# EasyEDA Pro project 通用F405飞控_2025-10-26.epro, board PCB1
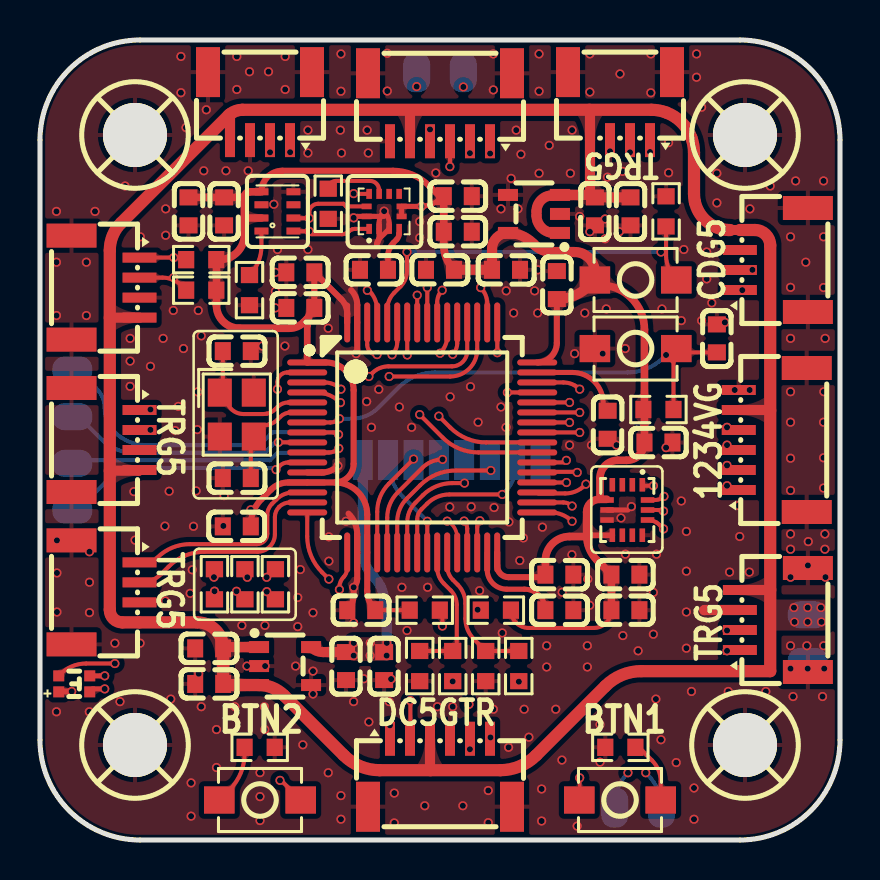
[diagram p3: board, top side]
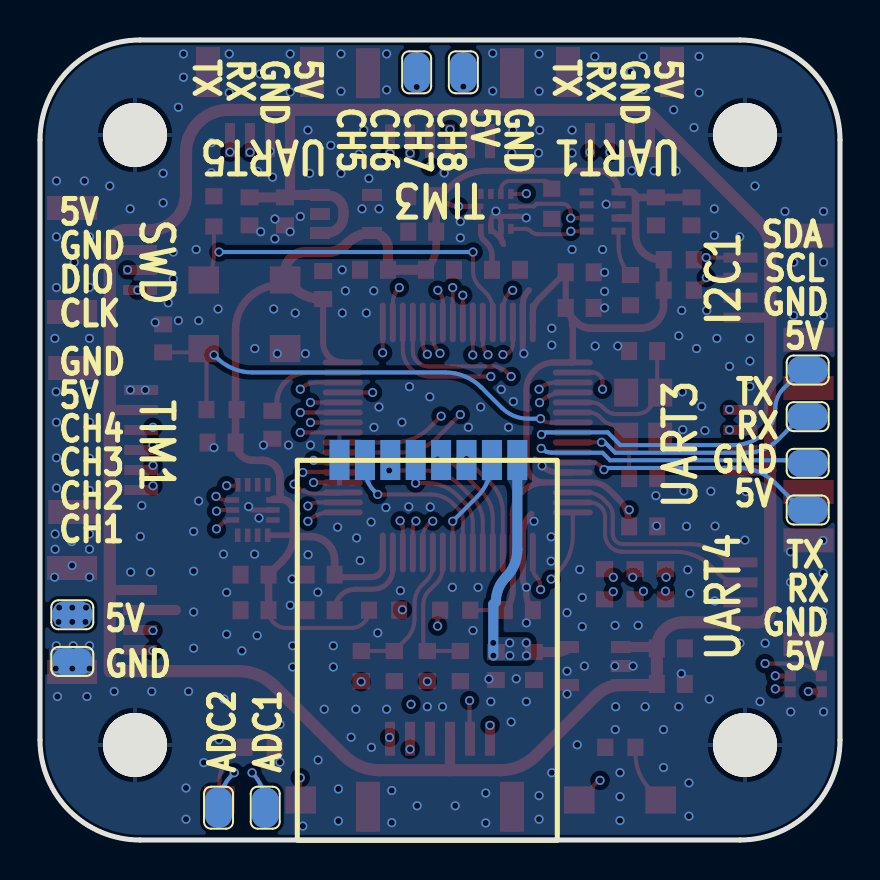
[diagram p4: board, bottom side, seen from below]

Outline 40 x 40 mm; copper layers: Top Layer, Inner1, Inner2, Bottom Layer. Coordinates in mm from the lower left corner of the outline.
Outline path: 0,35 0,5 arc(1.46,1.46) 5,0 35,0 arc(38.54,1.46) 40,5 40,35 arc(38.54,38.54) 35,40 5,40 arc(1.46,38.54) 0,35
Stack: Top Layer 0.035mm 外层铜厚1oz / Dielectric1 0.2104mm 7628 RC49% 8.6mil / Inner1 0.0152mm 内层铜厚 / Dielectric2 1.065mm 1.1mm H/HOZ Copper / Inner2 0.0152mm 内层铜厚 / Dielectric3 0.2104mm 7628 RC49% 8.6mil / Bottom Layer 0.035mm 外层铜厚1oz

## Design rules (mm)
template: 自定义配置
spacing copperThickness1oz (default): track to track 0.102, other pairs 0.152 to 0.3
spacing copperThickness2oz: track to track 0.203, other pairs 0.152 to 0.3
track width copperThickness1oz (default): min 0.127, default 0.254, max 2.54
track width copperThickness2oz: min 0.203, default 0.254, max 2.54
differential pair differentialPair (default): width min 0.127, default 0.254, max 2.54; gap min 0.152, default 0.152
via viaSize (default): diameter min 0.254, default 0.457, max 10; hole min 0.3, default 0.305, max 6.299

## Placement (name value [footprint] x y rotation side)
C1  10nF  [C0603]  30.92 19.87 180 top
C2  100nF  [C0603]  29.27 13.27 180 top
C3  2.2uF  [C0603]  29.27 11.49 180 top
C4  100nF  [C0603]  9.21 31.43 90 top
C5  100nF  [C0603]  7.43 31.43 90 top
C6  10uF  [C0603]  25.84 27.75 270 top
C7  100nF  [C0603]  20 28.51 0 top
C8  1uF  [C0603]  20.89 30.41 180 top
C9  100nF  [C0603]  20.89 32.19 180 top
C10  100nF  [C0603]  16.7 28.51 0 top
C12  100nF  [C0603]  13.01 26.6 0 top
C13  100nF  [C0603]  13.01 28.38 0 top
C14  100nF  [C0603]  16.06 11.49 0 top
C15  100nF  [C0603]  25.97 13.27 180 top
C16  100nF  [C0603]  23.3 28.51 180 top
C17  100nF  [C0603]  9.84 15.68 0 top
C20  2.2uF  [C0603]  28.38 20.76 90 top
C21  2.2uF  [C0603]  25.97 11.49 180 top
C42  30pF  [C0603]  9.84 18.09 180 top
C52  100nF  [C0603]  33.84 25.08 90 top
C70  30pF  [C0603]  9.84 24.44 180 top
C71  100nF  [C0603]  27.75 31.43 90 top
C72  10uF  [C0603]  29.53 31.43 90 top
C73  100nF  [C0603]  8.46 9.58 0 top
C74  100nF  [C0603]  17.21 8.7 90 top
C75  10uF  [C0603]  15.3 8.7 90 top
C76  10uF  [C0603]  8.46 7.8 0 top
H1  -  [飞控微型焊盘]  28.74 1.62 270 bottom
H2  -  [飞控微型焊盘]  31.07 1.62 270 bottom
H3  -  [飞控微型焊盘]  1.62 23.5 180 bottom
H4  -  [飞控微型焊盘]  1.62 21.17 180 bottom
H5  -  [飞控微型焊盘]  1.62 18.83 180 bottom
H6  -  [飞控微型焊盘]  1.62 16.5 180 bottom
H7  -  [飞控微型焊盘]  21.17 38.39 270 bottom
H8  -  [飞控微型焊盘]  18.83 38.39 270 bottom
H9  -  [飞控微型焊盘]  38.38 11.26 180 bottom
H10  -  [飞控微型焊盘]  38.38 8.93 180 bottom
LED1  XL-2012RGBC  [LED-SMD_4P-L2.0-W1.3-BR]  1.71 7.81 180 top
R1  10K  [R0603]  31.3 31.43 90 top
R2  10K  [R0603]  30.92 21.52 0 top
R3  1K  [R0603]  29.02 4.63 180 top
R4  1K  [R0603]  10.98 4.63 0 top
R5  4.7K  [R0603]  8.06 27.49 0 top
R6  4.7K  [R0603]  8.06 29.02 0 top
R7  4.7K  [R0603]  19.24 11.49 180 top
R8  4.7K  [R0603]  22.79 11.49 0 top
R9  10K  [R0603]  10.47 27.49 90 top
R10  0/1K  [R0603]  14.41 31.81 90 top
R12  150  [R0603]  8.72 12.79 270 top
R13  150  [R0603]  10.25 12.79 270 top
R14  150  [R0603]  11.77 12.79 270 top
R15  10K  [R0603]  20.63 8.7 270 top
R16  1K  [R0603]  18.98 8.7 90 top
R17  10K  [R0603]  23.94 8.7 270 top
R18  1K  [R0603]  22.29 8.7 90 top
SCREW1  -  [M3螺丝]  35.25 35.25 0 top
SCREW2  -  [M3螺丝]  4.75 4.75 0 top
SCREW3  -  [M3螺丝]  35.25 4.75 0 top
SCREW4  -  [M3螺丝]  4.75 35.25 0 top
SW1  TS342A2P-WZ  [SW-SMD_L4.0-W2.9-LS5.0]  29.78 24.57 0 top
SW2  TS342A2P-WZ  [SW-SMD_L4.0-W2.9-LS5.0]  29.78 28 0 top
SW3  TS342A2P-WZ  [SW-SMD_L4.0-W2.9-LS5.0]  29 2 180 top
SW4  TS342A2P-WZ  [SW-SMD_L4.0-W2.9-LS5.0]  11 2 0 top
U1  ICM-42688-P  [LGA-14_L3.0-W2.5-P0.50-TL]  29.37 16.5 270 top
U2  DPS310XTSA1  [LGA-8_DPS310XTSA1]  11.87 31.43 0 top
U4  LIS3MDLTR  [LGA-12_L2.0-W2.0-P0.50-BL]  17.21 31.43 0 top
U5  STM32F405RGT6  [LQFP-64_L10.0-W10.0-P0.50-LS12.0-BL]  19.11 20.13 270 top
U6  -  [G01-SPIPX]  20.63 18.98 270 bottom
U7  ZX-SH1.0-6PWT  [CONN-SMD_6P-P1.00_MEGASTAR_ZX-SH1.0-6PWT]  20 3.36 0 top
U44  ZX-SH1.0-4PWT  [CONN-SMD_4P-P1.00_MEGASTAR_ZX-SH1.0-4PWT]  36.69 29 90 top
U45  ZX-SH1.0-4PWT  [CONN-SMD_4P-P1.00_MEGASTAR_ZX-SH1.0-4PWT]  3.28 27.62 270 top
U46  ZX-SH1.0-4PWT  [CONN-SMD_4P-P1.00_MEGASTAR_ZX-SH1.0-4PWT]  3.28 12.38 270 top
U49  ZX-SH1.0-4PWT  [CONN-SMD_4P-P1.00_MEGASTAR_ZX-SH1.0-4PWT]  11 36.69 180 top
U50  ZX-SH1.0-4PWT  [CONN-SMD_4P-P1.00_MEGASTAR_ZX-SH1.0-4PWT]  3.28 20 270 top
U52  ME6217C33M5G  [SOT-23-5_L3.0-W1.7-P0.95-LS2.8-BR]  24.7 31.3 0 top
U53  ME6217C33M5G  [SOT-23-5_L3.0-W1.7-P0.95-LS2.8-BR]  12.25 8.7 180 top
U59  ZX-SH1.0-4PWT  [CONN-SMD_4P-P1.00_MEGASTAR_ZX-SH1.0-4PWT]  36.69 11 90 top
U60  ZX-SH1.0-4PWT  [CONN-SMD_4P-P1.00_MEGASTAR_ZX-SH1.0-4PWT]  29 36.69 180 top
U61  ME6217C33M5G  [CONN-SMD_6P-P1.00_MEGASTAR_ZX-SH1.0-6PWT]  36.64 20 90 top
U62  ME6217C33M5G  [CONN-SMD_6P-P1.00_MEGASTAR_ZX-SH1.0-6PWT]  20 36.64 180 top
X3  12MHz  [CRYSTAL-SMD_4P-L3.2-W2.5-BL]  9.84 21.27 270 top

## Footprints (pads in the part's own frame, mm; a bottom-side part is the same pattern mirrored in y, then rotated)
C0603
  rect 0.8x0.9 smd: 1(-0.7,0) 2(0.7,0)
CONN-SMD_4P-P1.00_MEGASTAR_ZX-SH1.0-4PWT
  rect 0.5x1.7 smd: 1(-1.5,1.7) 2(-0.5,1.7) 3(0.5,1.7) 4(1.5,1.7)
  rect 1.2x2.5 smd: 5(2.6,-1.7) 6(-2.6,-1.7)
CONN-SMD_6P-P1.00_MEGASTAR_ZX-SH1.0-6PWT
  rect 0.5x1.7 smd: 1(-2.5,1.7) 2(-1.5,1.7) 3(-0.5,1.7) 4(0.5,1.7) 5(1.5,1.7) 6(2.5,1.7)
  rect 1.2x2.5 smd: 7(3.6,-1.7) 8(-3.6,-1.7)
CRYSTAL-SMD_4P-L3.2-W2.5-BL
  rect 1.4x1.2 smd: 1(-1.1,-0.85) 2(1.1,-0.85) 3(1.1,0.85) 4(-1.1,0.85)
G01-SPIPX
  custom 2x1 smd: 1(-0.016,4.5) 2(-0.016,3.23) 3(-0.016,1.96) 4(-0.016,0.69) 5(-0.016,-0.58) 6(-0.016,-1.85) 7(-0.016,-3.12) 8(-0.016,-4.39)
LED-SMD_4P-L2.0-W1.3-BR
  rect 0.55x0.55 smd: 1(0.775,-0.4) 2(-0.775,-0.4) 3(0.775,0.4) 4(-0.775,0.4)
LGA-8_DPS310XTSA1
  rect 0.7x0.35 smd: 1(0.8,0.981) 2(0.8,0.33) 3(0.8,-0.33) 4(0.8,-0.981) 5(-0.8,-0.981) 6(-0.8,-0.33) 7(-0.8,0.33) 8(-0.8,0.981)
LGA-12_L2.0-W2.0-P0.50-BL
  rect 0.28x0.5 smd: 1(-0.75,-0.875) 2(-0.25,-0.875) 3(0.25,-0.875) 4(0.75,-0.875) 7(0.75,0.875) 8(0.25,0.875) 9(-0.25,0.875) 10(-0.75,0.875)
  rect 0.5x0.28 smd: 5(0.875,-0.25) 6(0.875,0.25) 11(-0.875,0.25) 12(-0.875,-0.25)
LGA-14_L3.0-W2.5-P0.50-TL
  rect 0.675x0.28 smd: 1(-1.262,0.75) 2(-1.262,0.25) 3(-1.262,-0.25) 4(-1.262,-0.75) 8(1.262,-0.75) 9(1.262,-0.25) 10(1.262,0.25) 11(1.262,0.75)
  rect 0.28x0.675 smd: 5(-0.5,-1.012) 6(0,-1.012) 7(0.5,-1.012) 12(0.5,1.012) 13(0,1.012) 14(-0.5,1.012)
LQFP-64_L10.0-W10.0-P0.50-LS12.0-BL
  oval 0.3x2 smd: 1(-3.75,-5.75) 2(-3.25,-5.75) 3(-2.75,-5.75) 4(-2.25,-5.75) 5(-1.75,-5.75) 6(-1.25,-5.75) 7(-0.75,-5.75) 8(-0.25,-5.75) 9(0.25,-5.75) 10(0.75,-5.75) 11(1.25,-5.75) 12(1.75,-5.75) 13(2.25,-5.75) 14(2.75,-5.75) 15(3.25,-5.75) 16(3.75,-5.75) 33(3.75,5.75) 34(3.25,5.75) 35(2.75,5.75) 36(2.25,5.75) 37(1.75,5.75) 38(1.25,5.75) 39(0.75,5.75) 40(0.25,5.75) 41(-0.25,5.75) 42(-0.75,5.75) 43(-1.25,5.75) 44(-1.75,5.75) 45(-2.25,5.75) 46(-2.75,5.75) 47(-3.25,5.75) 48(-3.75,5.75)
  oval 2x0.3 smd: 17(5.75,-3.75) 18(5.75,-3.25) 19(5.75,-2.75) 20(5.75,-2.25) 21(5.75,-1.75) 22(5.75,-1.25) 23(5.75,-0.75) 24(5.75,-0.25) 25(5.75,0.25) 26(5.75,0.75) 27(5.75,1.25) 28(5.75,1.75) 29(5.75,2.25) 30(5.75,2.75) 31(5.75,3.25) 32(5.75,3.75) 49(-5.75,3.75) 50(-5.75,3.25) 51(-5.75,2.75) 52(-5.75,2.25) 53(-5.75,1.75) 54(-5.75,1.25) 55(-5.75,0.75) 56(-5.75,0.25) 57(-5.75,-0.25) 58(-5.75,-0.75) 59(-5.75,-1.25) 60(-5.75,-1.75) 61(-5.75,-2.25) 62(-5.75,-2.75) 63(-5.75,-3.25) 64(-5.75,-3.75)
M3螺丝
  round 3.2 hole 3.2: 1(0,0)
R0603
  rect 0.806x0.864 smd: 1(-0.753,0) 2(0.753,0)
SOT-23-5_L3.0-W1.7-P0.95-LS2.8-BR
  rect 1x0.6 smd: 1(1.3,-0.95) 2(1.3,0) 3(1.3,0.95) 4(-1.3,0.95) 5(-1.3,-0.95)
SW-SMD_L4.0-W2.9-LS5.0
  rect 1.53x1.36 smd: 1(-2.035,0) 2(2.035,0)
飞控微型焊盘
  rrect 2x1.35 smd: 1(0,0)

## Nets
3V3: C1.2 C2.2 C3.2 C4.2 C5.2 C6.2 C7.2 C8.2 C9.2 C12.2 C13.2 C14.2 C15.2 C16.2 C17.2 LED1.3 R2.1 R5.2 R6.2 R7.2 R8.2 SW2.1 U1.5 U1.8 U2.6 U2.8 U4.5 U4.6 U4.10 U5.1 U5.13 U5.19 U5.32 U5.48 U5.64 U52.5
3V3_RF: C74.2 C75.2 U6.1 U53.5
5V: C71.2 C72.2 C73.2 C76.2 H9.1 U7.3 U44.4 U45.4 U46.4 U49.4 U50.4 U52.1 U52.3 U53.1 U53.3 U59.4 U60.4 U61.5 U62.5
GND: C1.1 C2.1 C3.1 C4.1 C5.1 C6.1 C7.1 C8.1 C9.1 C10.1 C12.1 C13.1 C14.1 C15.1 C16.1 C17.1 C20.1 C21.1 C42.2 C52.2 C70.1 C71.1 C72.1 C73.1 C74.1 C75.1 C76.1 H10.1 R1.2 R3.2 R4.2 R9.1 R10.1 R16.1 R18.1 SCREW1.1 SCREW2.1 SCREW3.1 SCREW4.1 SW1.1 U1.6 U1.7 U1.11 U2.1 U2.7 U4.2 U4.3 U4.12 U5.12 U5.18 U5.63 U6.8 U7.4 U7.7 U7.8 U44.3 U44.5 U44.6 U45.3 U45.5 U45.6 U46.3 U46.5 U46.6 U49.3 U49.5 U49.6 U50.3 U50.5 U50.6 U52.2 U52.4 U53.2 U53.4 U59.3 U59.5 U59.6 U60.3 U60.5 U60.6 U61.6 U61.7 U61.8 U62.6 U62.7 U62.8 X3.2 X3.4
ADC1: R15.1 R16.2 U5.26
ADC2: R17.1 R18.2 U5.27
BOOT0: R1.1 SW2.2 U5.60
BUTTON1: SW3.2 U5.28
BUTTON2: SW4.2 U5.45
G01_CE: U5.25 U6.2
G01_CS: U5.20 U6.3
G01_IRQ: U5.24 U6.7
G01_MISO: U5.22 U6.6
G01_MOSI: U5.23 U6.5
G01_SCK: U5.21 U6.4
GPIO1: H3.1 U5.8
GPIO2: H4.1 U5.9
GPIO3: H5.1 U5.10
GPIO4: H6.1 U5.11
I2C1_SCL: R5.1 U2.4 U4.1 U5.61 U45.2
I2C1_SDA: R6.1 U2.3 U4.11 U5.62 U45.1
I2C2_SCL: R7.1 U5.29 U7.2
I2C2_SDA: R8.1 U5.30 U7.1
LED1: R12.1 U5.2
LED2: R13.1 U5.3
LED3: R14.1 U5.4
LIS_ADDR: R10.2 U4.9
NRST: C52.1 R2.2 SW1.2 U5.7
OSCIN: C70.2 U5.5 X3.1
OSCOUT: C42.1 U5.6 X3.3
SPI2_CS: U1.12 U5.33
SPI2_MISO: U1.1 U5.35
SPI2_MOSI: U1.14 U5.36
SPI2_SCK: U1.13 U5.34
SWCLK: U5.49 U44.1
SWDIO: U5.46 U44.2
TIM1_CH1: U5.41 U61.1
TIM1_CH2: U5.42 U61.2
TIM1_CH3: U5.43 U61.3
TIM1_CH4: U5.44 U61.4
TIM2_CH1: H7.1 U5.50
TIM2_CH2: H8.1 U5.55
TIM3_CH1: U5.56 U62.1
TIM3_CH2: U5.57 U62.2
TIM3_CH3: U5.39 U62.3
TIM3_CH4: U5.40 U62.4
UART1_RX: U5.59 U49.2
UART1_TX: U5.58 U49.1
UART2_RX: U5.17 U7.6
UART2_TX: U5.16 U7.5
UART3_RX: U5.52 U50.2
UART3_TX: U5.51 U50.1
UART4_RX: U5.15 U46.2
UART4_TX: U5.14 U46.1
UART5_RX: U5.54 U60.2
UART5_TX: U5.53 U60.1
UART6_RX: U5.38 U59.2
UART6_TX: U5.37 U59.1
$1N1015: R9.2 U2.5
$1N2558: C10.2 U4.4
$1N22340: C20.2 U5.47
$1N22341: C21.2 U5.31
$1N24539: R3.1 SW3.1
$1N24657: R4.1 SW4.1
$1N24972: LED1.1 R12.2
$1N24975: LED1.2 R13.2
$1N24978: LED1.4 R14.2
$1N25196: H1.1 R15.2
$1N25385: H2.1 R17.2

Pads without a net: U1 2 3 4 9 10; U2 2; U4 7 8

## Via types
v1: diameter 0.457, hole 0.305, Top Layer to Bottom Layer, 404 vias

## Routing (per net, layer and track width the routed paths; a pad name or vN(x,y) marks a point on that pad's centre or on a via; arc(x,y) is an arc through that point)
3V3: length 136
  Top Layer w0.203: v1(15.68,32.32) 15.7,32.31 U4.10 ; 16.76,11.49 R7.2 ; R8.2 arc(23.81,10.86) 24.44,10.6 27.68,10.6 arc(28.31,10.86) C3.2
  Top Layer w0.254: 18.95,31.68 U4.6 U4.5 ; 18.95,31.68 v1(19.07,31.68) ; 18.95,31.68 arc(19.4,31.74) 19.82,31.91 arc(20.01,32.04) 20.19,32.19
  Top Layer w0.28: U1.8 27.34,15.24 arc(27.34,15.24) 27.33,15.24
  Top Layer w0.305: C6.2 25.84,24.86 arc(25.56,24.16) U5.48 ; U5.32 22.86,13.71 arc(23.03,13.31) 23.43,13.14 25.14,13.14 arc(25.23,13.18) C15.2 ; v1(1.59,7.43) 0.96,7.43 0.94,7.41 ; 14.76,17.88 U5.13 12.41,17.88 arc(11.95,17.78) 11.55,17.52 11.07,17.04 arc(10.84,16.76) 10.68,16.45 arc(10.57,16.11) 10.54,15.76 C17.2 ; 14.76,17.88 arc(15.89,17.41) 16.36,16.27 U5.19 16.36,12.46 arc(16.47,11.94) 16.76,11.49 ; 14.76,17.88 arc(15.41,18.15) 15.68,18.8 15.68,22.5 arc(15.28,23.47) 14.3,23.88 U5.1 ; 19.97,32.19 19.44,32.72 arc(18.62,33.27) 17.65,33.46 12.12,33.46 arc(11.38,33.15) U2.8 ; 13.72,26.6 13.72,28.38 15.06,27.04 arc(15.28,26.7) 15.36,26.31 U5.64
  Top Layer w0.33: 13.36,25.75 U5.1
  Top Layer w0.381: U2.6 10.23,31.1 ; U2.8 10.5,32.41 arc(10.3,32.33) 10.22,32.13 ; 20.19,32.19 20.19,29.74 arc(20.32,29.08) C7.2 ; 27.74,27.75 28,27.75 arc(29.57,27.1) 30.22,25.52 C1.2 arc(29.96,19.24) 29.33,18.98 28.89,18.98 arc(28.26,18.72) 28,18.09 28,17.15 ; C15.2 25.27,13.97 arc(25.62,14.82) 26.48,15.17 27.28,15.17 arc(27.31,15.18) 27.33,15.21 ; 27.33,15.24 27.33,16.4 arc(27.52,16.85) 27.97,17.03 28.34,17.03 ; C5.2 C4.2 10.22,32.13 10.22,32.13 ; 10.22,32.13 10.22,30.27 arc(9.86,29.38) 8.97,29.02 R6.2 arc(8.82,29.01) 8.82,29.01 8.82,26.73 arc(9.16,25.92) 9.97,25.59 12.46,25.59 arc(12.86,25.67) 13.19,25.89 13.36,26.06 13.36,25.75 arc(13.38,25.94) 13.42,26.12 arc(13.54,26.38) 13.72,26.6 ; C3.2 C2.2 27.86,13.98 arc(27.48,14.55) 27.33,15.21 ; 27.33,15.21 arc(27.34,15.22) 27.34,15.24
  Top Layer w0.508: C7.2 22.41,28.51 ; C16.2 22.6,29.56 arc(22.84,30.12) U52.5 arc(24.07,30.22) 24.64,29.84 24.7,29.78 arc(25.12,29.5) 25.62,29.4 26.73,29.4 arc(27.45,29.1) 27.74,28.39 SW2.1 27.46,27.72 arc(26.72,27.22) C6.2 ; 27.74,27.91 27.74,27.75
  Inner1 w0.203: v1(15.68,32.32) 17.53,32.32 arc(18.37,32.15) v1(19.07,31.68)
  Inner1 w0.305: v1(1.59,7.43) 1.59,13.97 arc(2.33,15.77) 4.12,16.51 v1(10.54,16.51)
3V3_RF: length 11.9
  Top Layer w0.508: C75.2 14.16,9.4 arc(13.83,9.46) U53.5
  Bottom Layer w0.508: v1(17.33,9.22) 17.33,11.79 17.21,11.92 arc(17.07,12.58) 16.7,13.14 arc(16.28,13.77) 16.13,14.5 U6.1
  vias: v1(15.69,9.86) v1(15.68,9.22) v1(16.51,9.86) v1(16.51,9.22) v1(17.34,9.86)
5V: length 142
  Top Layer w0.508: 9.21,9.63 9.22,9.65 U53.1 ; 36.51,21.47 36.48,21.5 U61.5 ; 27.46,36.51 27.5,36.47 27.5,32.25 ; U7.3 19.5,3.51 19.52,3.49 ; 18.48,36.38 18.5,36.36 U62.5 ; U52.1 25.7,30.35 arc(25.08,30.61) 24.83,31.23 24.83,31.44 arc(25.06,32) 25.62,32.23 ; U50.4 4.94,18.47 3.49,18.47 ; C72.2 C71.2 ; U52.3 27.5,32.25 ; 9.5,35 9.5,36.29 ; U59.4 36.49,12.5 arc(36.5,12.5) 36.51,12.51 ; 3.49,26.12 3.49,26.12 U45.4
  Top Layer w0.61: U44.4 35.74,30.5 arc(36.28,30.27) 36.51,29.73 36.51,8.44 30.07,8.44 arc(29.1,8.25) 28.27,7.7 24.81,4.23 arc(23.98,3.68) 23.01,3.49 16.99,3.49 arc(16.02,3.68) 15.19,4.23 12.19,7.23 arc(11.62,7.61) U53.3 9.21,7.75 arc(9.17,7.76) C76.2 C73.2 arc(8.78,10.5) 7.86,10.88 U46.4 4.12,10.88 arc(3.67,11.06) 3.49,11.51 3.49,29.49 arc(3.64,30.23) 4.05,30.85 9.43,36.22 arc(9.46,36.26) 9.5,36.29 arc(9.79,36.45) 10.12,36.51 30.56,36.51 arc(30.94,36.48) 31.31,36.37 arc(32.07,35.88) 32.56,35.12 arc(32.67,34.75) 32.7,34.37 32.7,32.3 arc(32.71,32.09) 32.75,31.89 arc(33.23,31.03) 34.09,30.54 arc(34.24,30.52) 34.4,30.5 arc(34.45,30.5) 34.5,30.5
  vias: v1(37.7,11.62) v1(37.73,10.9) v1(38.38,11.62) v1(38.38,10.9) v1(39.04,11.62) v1(39.07,10.9)
GND: length 18.1
  Top Layer w0.254: 17.03,31.18 U4.12 15.86,31.18 arc(15.77,31.16) v1(15.69,31.11) ; 17.03,31.18 17.21,31.18 ; 17.03,31.18 arc(16.97,31.01) 16.96,30.84 U4.2 16.96,30.1 arc(16.96,30.07) 16.95,30.05 ; 17.03,31.18 arc(17.1,31.32) v1(17.21,31.44) arc(17.39,31.17) 17.46,30.84 U4.3 16.95,30.05 ; 16.95,30.05 16.93,30.03 arc(16.85,29.91) 16.82,29.78 arc(16.91,29.9) 16.95,30.05 ; U1.6 29.4,16.5
  Top Layer w0.305: U5.12 14.09,18.38 arc(14.53,18.46) v1(14.9,18.71) ; 15.43,16.32 arc(15.75,15.84) 15.86,15.27 U5.18 15.86,13.07 arc(15.81,12.83) v1(15.68,12.63) 15.68,12.26 arc(15.6,11.84) C14.1 ; v1(15.81,24.32) arc(15.85,24.38) 15.86,24.44 U5.63 15.86,26.75 arc(15.78,27.15) 15.56,27.49
  Top Layer w0.508: U59.3 33.23,11.5 arc(33.22,11.5) 33.21,11.49
  vias: v1(0.82,31.43) v1(0.82,28.89) v1(0.82,26.22) v1(0.85,14.98) v1(0.85,13.35) v1(0.85,11.4) v1(0.82,6.41) v1(2.32,28.89) v1(2.32,26.22) v1(2.47,14.41) v1(2.47,12.89) v1(2.47,11.37) v1(2.47,6.41) v1(2.75,31.43) v1(3.74,9.84) v1(4,6.92) v1(4.25,32.7) v1(4.51,25.08) v1(4.51,23.95) v1(4.51,22.68) v1(4.69,17.42) v1(4.75,15) v1(5.01,30.16) v1(5,9.84) v1(5.52,23.68) v1(6.16,25.08) v1(6.25,15.69) v1(6.28,31.56) v1(6.28,30.24) v1(6.26,11.95) v1(6.46,17.44) v1(6.54,7.05) v1(6.66,26.48) v1(6.75,20.47) v1(6.92,21.68) v1(7.05,39.18) v1(7.05,37.37) v1(7.17,24.57) v1(7.3,35.62) v1(7.51,12.33) v1(7.61,13.51) v1(7.55,2.86) v1(7.55,1.19) v1(7.67,15.68) v1(7.81,17.46) v1(7.91,26.48) v1(7.88,22.41) v1(7.86,20.52) v1(7.94,8.32) v1(8.06,25.21) v1(8.06,6.67) v1(8.19,33.46) v1(8.32,36.51) v1(8.82,5.52) v1(8.82,3.62) v1(9.21,17.22) v1(9.17,15.7) v1(9.3,33.46) v1(9.74,6.67) v1(9.84,39.18) v1(9.84,37.53) v1(10.09,10.73) v1(10.35,8.7) v1(10.41,33.46) v1(10.47,38.42) v1(11,3.37) v1(11,2.17) v1(11,0.97) v1(11.11,24.7) v1(11.25,10.73) v1(11.22,6.67) v1(11.24,5.52) v1(11.26,8.7) v1(11.43,38.42) v1(11.69,31.79) v1(11.77,28.38) v1(11.77,27.43) v1(11.77,26.61) v1(11.87,29.53) v1(12.24,24.7) v1(12.26,39.18) v1(12.26,37.53) v1(12.78,8.7) v1(12.89,12.13) v1(12.89,10.67) v1(13.01,13.52) v1(13.14,4.76) v1(13.4,35.49) v1(13.4,34.35) v1(13.4,29.53) v1(13.65,11.36) v1(13.65,8.44) v1(13.65,7.3) v1(14.41,25.59) v1(14.41,24.75) v1(14.44,15.16) v1(14.44,13.94) v1(14.41,3.36) v1(15.05,39.3) v1(15.05,37.44) v1(15.02,35.49) v1(15.05,2.22) v1(15.05,1.04) v1(15.07,34.35) v1(15.3,15.94) v1(15.68,10.86) v1(15.68,6.92) v1(16.19,8.06) v1(16.33,21.92) v1(16.36,35.49) v1(16.41,34.35) v1(16.44,5.9) v1(16.57,20.64) v1(16.94,22.53) v1(17.36,39.34) v1(17.36,37.45) v1(17.46,6.92) v1(17.56,8.05) v1(17.71,2.35) v1(17.71,0.85) v1(17.97,21.65) v1(18.09,12.63) v1(18.35,10.47) v1(18.58,20.64) v1(18.98,30.92) v1(18.98,30.11) v1(19.24,1.71) v1(19.38,12.63) v1(19.79,33.35) v1(19.87,6.67) v1(20.51,22.16) v1(20.49,16.65) v1(20.63,6.67) v1(21.14,1.71) v1(21.52,22.67) v1(21.56,16.66) v1(21.91,20.89) v1(21.98,12.47) v1(22.41,2.47) v1(22.41,0.87) v1(22.67,39.3) v1(22.67,37.51) v1(22.7,16.62) v1(22.67,6.54) v1(23.05,31.56) v1(23.05,21.65) v1(23.11,10.35) v1(23.31,27.46) v1(23.3,20.64) v1(23.44,15.9) v1(23.43,4.63) v1(23.56,33.08) v1(23.68,26.35) v1(23.81,35.49) v1(23.9,31.56) v1(24.05,34.29) v1(23.99,13.97) v1(24.17,15.1) v1(24.21,6.54) v1(24.44,5.14) v1(24.73,27.46) v1(24.89,28.51) v1(24.88,26.35) v1(24.95,39.3) v1(24.95,37.44) v1(24.95,33.33) v1(25.12,15.64) v1(25.08,2.55) v1(25.08,0.95) v1(25.33,9.71) v1(25.33,8.65) v1(25.46,34.73) v1(25.79,6.54) v1(26.11,12.39) v1(26.1,4) v1(26.52,33.33) v1(26.48,19.75) v1(26.6,35.49) v1(26.6,14.26) v1(26.73,24.32) v1(26.86,0.7) v1(26.99,31.18) v1(27.24,26.35) v1(27.39,13.05) v1(27.37,9.71) v1(27.37,8.65) v1(27.49,39.3) v1(27.49,37.4) v1(27.49,30.41) v1(27.49,11.74) v1(27.57,19.75) v1(28,5.78) v1(28,3.89) v1(28.13,24.32) v1(28.25,31.05) v1(28.25,30.06) v1(28.32,26.55) v1(28.37,33.14) v1(28.5,34.44) v1(28.83,19.75) v1(29,38.3) v1(28.97,30.41) v1(29.05,16.1) v1(29.13,33.43) v1(29.14,10.22) v1(29.26,24.57) v1(29.27,14.29) v1(29.57,16.67) v1(29.91,9.46) v1(30.54,39.3) v1(30.54,37.36) v1(30.67,12.38) v1(30.67,10.29) v1(30.83,14.29) v1(30.79,7.05) v1(31.05,5.01) v1(31.1,26.55) v1(31.3,19.62) v1(31.43,34.87) v1(31.43,33.36) v1(31.81,3.87) v1(32.06,25.97) v1(32.06,16.95) v1(32.19,29.53) v1(32.32,15.43) v1(32.32,13.44) v1(32.32,11.4) v1(32.32,9.59) v1(32.57,7.43) v1(32.7,2.6) v1(32.7,1.04) v1(32.83,39.3) v1(32.83,38.14) v1(33.08,36.64) v1(33.08,25.97) v1(33.34,29.4) v1(33.34,28.06) v1(33.59,26.86) v1(33.84,33.33) v1(33.84,31.86) v1(34.24,25.88) v1(34.41,7.43) v1(34.48,13.4) v1(34.74,22.5) v1(34.91,16.72) v1(34.99,15.17) v1(35.49,31.56) v1(35.48,22.5) v1(35.47,13.4) v1(36.29,7.43) v1(36.51,32.7) v1(37.53,30.16) v1(37.53,27.63) v1(37.53,25.08) v1(37.53,22.41) v1(37.53,20.89) v1(37.53,19.09) v1(37.53,17.48) v1(37.53,15.3) v1(37.53,14.54) v1(37.53,13.14) v1(37.53,9.71) v1(37.53,8.57) v1(37.65,7.17) v1(37.78,32.95) v1(38.29,28.89) v1(38.34,9.71) v1(38.41,14.92) v1(38.4,13.73) v1(38.38,8.57) v1(39.13,7.17) v1(39.18,32.95) v1(39.18,30.16) v1(39.18,27.62) v1(39.19,22.41) v1(39.18,20.89) v1(39.18,19.11) v1(39.18,17.6) v1(39.24,15.3) v1(39.24,14.54) v1(39.19,9.71) v1(39.21,8.57) v1(39.26,25.08) v1(39.27,13.14)
ADC1: length 6.7
  Top Layer w0.203: U5.26 19.86,13.62 arc(19.95,13.19) 20.19,12.83 20.54,12.48 arc(20.76,12.14) 20.84,11.75 20.84,9.65 ; R16.2 R15.1
ADC2: length 7.2
  Top Layer w0.203: U5.27 20.36,13.69 arc(20.44,13.32) 20.65,13 20.89,12.76 arc(21.17,12.34) 21.27,11.84 21.27,11.08 arc(21.38,10.51) 21.7,10.03 R18.2 R17.1
BOOT0: length 19.3
  Top Layer w0.203: R1.1 31.3,29.23 arc(31.44,28.57) SW2.2 ; v1(18.35,29.4) 18.35,28.45 arc(18.27,28.04) 18.03,27.68 17.71,27.37 arc(17.45,26.98) 17.36,26.51 U5.60
  Bottom Layer w0.203: v1(18.35,29.4) v1(31.05,29.4)
BUTTON1: length 20.4
  Top Layer w0.178: U5.28 20.86,15.1 arc(20.78,15.48) 20.57,15.81 20.54,15.84 arc(20.47,15.88) 20.39,15.9 ; v1(26.99,3.11) 26.99,2.02 arc(26.98,2.01) SW3.2
  Inner1 w0.178: v1(26.99,3.11) 26.99,4.12 arc(26.46,5.38) 25.21,5.9 22.29,5.9 arc(21.69,6.15) 21.45,6.74 v1(21.45,6.78)
  Inner2 w0.178: v1(21.45,6.78) 21.45,9.61 arc(21.32,10.26) 20.95,10.81 arc(20.48,11.52) 20.32,12.34 20.32,15.92
  vias: v1(20.36,15.94)
BUTTON2: length 28.3
  Top Layer w0.203: U5.45 23.37,22.38 v1(23.37,22.38) ; SW4.2 12.05,2.98
  Inner1 w0.203: v1(23.37,22.38) 23.17,22.38 arc(22.2,22.18) 21.38,21.63 20.25,20.5 arc(19.55,20.04) 18.73,19.87 arc(18.08,19.74) 17.52,19.37 12.74,14.59 arc(12.19,13.77) 12,12.8 v1(12,2.98)
G01_CE: length 5.3
  Top Layer w0.203: U5.25 19.37,14.38 v1(19.37,15.94)
  Bottom Layer w0.203: U6.2 17.41,18.95 arc(17.6,17.98) 18.15,17.15 v1(19.37,15.94)
G01_CS: length 5.3
  Top Layer w0.203: v1(18.68,19.05) 17.44,17.81 arc(17.01,17.17) 16.86,16.41 U5.20
G01_IRQ: length 8.4
  Top Layer w0.203: U5.24 18.86,16.03 arc(18.91,16.3) 19.07,16.53 19.36,16.82 arc(19.87,17.16) 20.47,17.28 v1(23.12,17.28)
  Bottom Layer w0.203: U6.7 23.75,18.59 arc(23.63,17.97) 23.28,17.44 v1(23.12,17.28)
G01_MISO: length 7.5
  Top Layer w0.203: v1(22.54,18.48) 20.8,18.48 arc(19.83,18.28) 19,17.73 18.34,17.07 arc(17.99,16.54) 17.86,15.92 U5.22
G01_MOSI: length 6.5
  Top Layer w0.203: v1(21.22,17.84) 20.61,17.84 arc(19.81,17.69) 19.14,17.24 18.77,16.87 arc(18.47,16.41) 18.36,15.88 U5.23
  Bottom Layer w0.203: v1(21.22,17.84) 21.22,17.85 U6.5
G01_SCK: length 6.2
  Top Layer w0.203: U5.21 17.36,16.11 arc(17.5,16.8) 17.89,17.38 19.12,18.61 arc(19.58,18.92) v1(20.13,19.03)
  Bottom Layer w0.203: v1(20.13,19.03) 20.1,19 U6.4
GPIO1: length 17.3
  Top Layer w0.203: U5.8 14.68,20.38 arc(14.81,20.35) v1(14.93,20.27)
  Bottom Layer w0.203: H3.1 1.9,23.5 2.82,22.57 arc(3.13,22.11) 3.24,21.58 arc(3.36,20.94) 3.72,20.4 arc(4.45,19.92) 5.31,19.75 10.98,19.75 11.62,20.38 14.67,20.38 arc(14.81,20.35) v1(14.93,20.27)
GPIO2: length 12.6
  Top Layer w0.203: v1(11.92,19.89) 13.35,19.89 U5.9
  Bottom Layer w0.203: v1(11.92,19.89) 11.76,19.89 11.24,19.36 4.67,19.36 arc(3.81,19.53) 3.09,20.02 1.94,21.17 H4.1
GPIO3: length 15.2
  Top Layer w0.203: U5.10 14.45,19.38 arc(14.71,19.43) v1(14.94,19.58)
  Bottom Layer w0.203: H5.1 1.77,18.98 11.49,18.98 11.87,19.36 14.42,19.36 arc(14.7,19.42) v1(14.94,19.58)
GPIO4: length 12.7
  Top Layer w0.203: U5.11 12.4,18.88 arc(12.18,18.83) 11.99,18.71 v1(11.8,18.52)
  Bottom Layer w0.203: H6.1 1.9,16.5 3.25,17.86 arc(4.08,18.41) 5.05,18.6 11.6,18.6 arc(11.71,18.58) v1(11.8,18.52)
I2C1_SCL: length 19.8
  Top Layer w0.203: U4.1 15.74,30.56 arc(15.69,30.55) 15.63,30.54 arc(15.53,30.5) 15.45,30.44 arc(15.28,30.33) 15.09,30.29 13.57,30.29 ; v1(13.46,30.44) 12.69,30.44 U2.4 ; R5.1 7.07,27.73 arc(6.64,28.02) 6.13,28.12 U45.2 ; U5.61 16.86,26.48 arc(16.75,27.02) 16.45,27.47
  Inner1 w0.203: v1(6.68,28.12) 8.25,29.69 arc(9.08,30.24) 10.05,30.44 v1(13.46,30.44) arc(13.57,30.41) 13.67,30.35 16.25,27.77 arc(16.34,27.64) v1(16.37,27.48)
I2C1_SDA: length 24.5
  Top Layer w0.203: U5.62 16.36,24.76 arc(16.5,24.41) v1(16.85,24.27) ; U45.1 4.98,29.12 v1(6.69,29.12) 7.2,29.12 R6.1 ; 12.67,31.1 12.68,31.09 v1(13.46,31.09) 13.46,31.37 arc(13.59,31.68) 13.9,31.81 15.17,31.81 15.31,31.68 U4.11
  Inner1 w0.203: v1(6.69,29.12) 7.92,30.35 arc(8.74,30.9) 9.71,31.09 v1(13.46,31.09) arc(13.6,31.07) 13.71,30.99 16.67,28.03 arc(17.18,27.26) 17.36,26.36 17.36,25.47 arc(17.23,24.83) 16.87,24.29 v1(16.85,24.27)
I2C2_SCL: length 14.2
  Top Layer w0.203: U7.2 18.52,5.08 v1(18.52,6.97) ; U5.29 21.36,15.57 arc(21.32,15.78) v1(21.21,15.95) ; R7.1 20.12,11.36 v1(20.12,10.7)
  Inner1 w0.203: v1(18.52,6.97) 18.52,8.05 arc(18.71,9.02) 19.26,9.84 v1(20.12,10.7) 20.15,10.7 20.35,10.89 arc(20.65,11.35) 20.76,11.89 20.76,14.88 arc(20.88,15.46) v1(21.21,15.95)
I2C2_SDA: length 14.4
  Top Layer w0.203: U5.30 21.86,15.64 arc(21.9,15.81) v1(21.99,15.96)
  Inner1 w0.203: v1(17.5,5.73) 17.88,5.73 arc(18.17,5.77) 18.44,5.87 arc(18.75,6.09) 18.98,6.4 arc(19.08,6.67) 19.11,6.96 19.11,7.69 arc(19.3,8.67) 19.85,9.49 20.68,10.32 arc(21.12,10.97) 21.27,11.73 21.27,14.21 arc(21.46,15.16) v1(21.99,15.96) ; 21.27,11.49 21.82,11.49 arc(21.85,11.5) v1(21.88,11.52)
LED1: length 15.1
  Top Layer w0.203: R12.1 8.7,13.51 v1(8.7,13.14) ; v1(11.87,22.54) 11.87,22.89 arc(12.01,23.23) 12.36,23.38 U5.2
  Inner1 w0.203: v1(11.87,22.54) 12.63,22.54 arc(13.17,22.32) 13.4,21.78 13.4,18.51 arc(13.2,17.54) 12.65,16.72 9.35,13.41 arc(9.05,13.21) v1(8.7,13.14)
LED2: length 13.8
  Top Layer w0.203: U5.3 14.23,22.88 arc(14.67,22.79) v1(15.05,22.54) ; v1(10.36,13.14) 10.25,13.25 R13.1
  Inner1 w0.203: v1(15.05,22.54) 14.54,22.54 arc(14,22.32) 13.78,21.78 13.78,18.13 arc(13.58,17.16) 13.03,16.33 10.74,14.04 arc(10.46,13.63) v1(10.36,13.14)
LED3: length 12.7
  Top Layer w0.203: v1(11.33,13.14) 11.37,13.14 R14.1 ; U5.4 13.79,22.38 arc(14.46,22.24) v1(15.02,21.87)
  Inner1 w0.203: v1(15.02,21.87) 14.88,21.87 arc(14.37,21.66) 14.16,21.14 14.16,17.81 arc(13.96,16.84) 13.41,16.01 11.9,14.5 arc(11.48,13.87) v1(11.33,13.14)
LIS_ADDR: length 3.2
  Top Layer w0.203: 16.96,32.5 U4.9 ; 16.95,32.5 arc(16.82,32.82) 16.5,32.95 14.8,32.95 arc(14.53,32.84) R10.2
NRST: length 24
  Top Layer w0.203: R2.2 31.68,23.88 v1(31.3,24.25) ; U5.7 14.52,20.88 arc(14.76,20.93) v1(14.97,21.06) ; C52.1 32.01,24.38 SW1.2
  Bottom Layer w0.203: v1(31.3,24.25) 31.17,24.12 arc(30.35,23.57) 29.38,23.38 19.73,23.38 arc(18.76,23.18) 17.93,22.63 16.91,21.6 arc(16.31,21.2) 15.6,21.06 v1(14.97,21.06)
OSCIN: length 6.3
  Top Layer w0.203: C70.2 9.14,22.47 ; U5.5 12.41,21.88 arc(12.12,21.82) 11.88,21.66 11.76,21.54 arc(11.56,21.39) 11.33,21.31 arc(11.25,21.3) 11.18,21.3 10.17,21.3 arc(10.16,21.3) 10.16,21.3 arc(9.71,21.43) 9.4,21.78
OSCOUT: length 4.3
  Top Layer w0.203: 11.11,20.74 11.21,20.74 arc(11.33,20.75) 11.44,20.77 arc(11.67,20.86) 11.87,21.02 12.01,21.16 arc(12.26,21.32) 12.54,21.38 U5.6 ; C42.1 10.54,19.92
SPI2_CS: length 7.8
  Top Layer w0.203: v1(31.18,15.56) 30.98,15.75 arc(30.91,15.82) 30.82,15.87 arc(30.61,15.97) U1.12 ; U5.33 25.54,16.38 arc(26.12,16.26) v1(26.6,15.94)
  Inner1 w0.203: v1(26.6,15.94) 26.75,15.79 arc(27.57,15.24) 28.54,15.05 29.95,15.05 arc(30.61,15.18) v1(31.18,15.56)
SPI2_MISO: length 6.4
  Top Layer w0.203: v1(30.67,17.71) 30.16,17.71 U1.1 ; v1(27.3,17.79) 27.24,17.73 arc(26.79,17.43) 26.26,17.33 24.91,17.33
  Inner1 w0.203: v1(27.3,17.79) 30.59,17.79
SPI2_MOSI: length 7.4
  Top Layer w0.203: U1.14 30.76,17 arc(31,17.05) v1(31.2,17.18) ; v1(26.32,17.87) 24.86,17.87 U5.36
  Inner1 w0.203: v1(26.32,17.87) 26.33,17.87 26.65,17.56 arc(27.07,17.28) 27.56,17.18 31.19,17.18 v1(31.2,17.18)
SPI2_SCK: length 7.8
  Top Layer w0.203: U1.13 31.04,16.5 arc(31.11,16.49) v1(31.18,16.44) ; U5.34 26.17,16.88 arc(26.41,16.83) v1(26.6,16.7)
  Inner1 w0.203: v1(31.18,16.44) 30.92,16.19 arc(30.22,15.72) 29.39,15.56 28.8,15.56 arc(27.83,15.75) 27,16.3 v1(26.6,16.7)
SWCLK: length 17.8
  Top Layer w0.203: v1(22.87,24.36) 22.87,25.87 arc(22.87,25.88) U5.49
  Inner1 w0.203: v1(35.11,27.49) 35.11,25.59 arc(34.39,23.85) 32.66,23.13 24.1,23.13 arc(23.23,23.49) v1(22.87,24.36)
SWDIO: length 15.5
  Top Layer w0.203: U5.46 26.17,22.88 arc(26.61,22.79) v1(26.99,22.54)
  Inner1 w0.203: v1(35.62,28.51) 35.62,25.59 arc(34.73,23.43) 32.57,22.54 v1(26.99,22.54)
TIM1_CH1: length 10.5
  Top Layer w0.203: U5.41 v1(26.99,20.38)
  Inner1 w0.203: v1(34.35,17.71) 32.13,19.94 arc(31.64,20.26) 31.07,20.38 v1(26.99,20.38)
TIM1_CH2: length 10.2
  Top Layer w0.203: U5.42 v1(26.48,20.88)
  Inner1 w0.203: v1(26.48,20.88) 30.72,20.88 arc(32.09,20.6) 33.25,19.83 v1(34.35,18.73)
TIM1_CH3: length 10
  Top Layer w0.203: U5.43 v1(26.99,21.38)
  Inner1 w0.203: v1(34.35,19.75) 33.99,20.11 arc(32.58,21.05) 30.93,21.38 v1(26.99,21.38)
TIM1_CH4: length 9.8
  Top Layer w0.203: U5.44 v1(26.48,21.88)
  Inner1 w0.203: v1(26.48,21.88) 31.35,21.88 arc(32.98,21.55) v1(34.35,20.64)
TIM2_CH1: length 12.9
  Top Layer w0.203: U5.50 22.36,26.83 arc(22.28,27.26) v1(22.03,27.62)
  Inner1 w0.203: v1(22.03,27.62) 22.03,31.74 arc(22.22,32.69) 22.75,33.48 arc(23.08,33.97) 23.19,34.54 23.19,34.88 arc(23.05,35.57) 22.66,36.16 v1(21.17,37.65)
TIM2_CH2: length 12.2
  Top Layer w0.203: U5.55 19.86,26.89 arc(19.93,27.21) v1(20.11,27.49)
  Inner1 w0.203: v1(20.11,27.49) 20.11,31.15 arc(19.97,31.85) 19.58,32.44 arc(19.03,33.26) 18.83,34.23 v1(18.83,37.67)
TIM3_CH1: length 9.6
  Top Layer w0.203: U5.56 19.37,25.88 v1(19.37,27.62)
  Inner2 w0.203: v1(22.51,34.32) arc(22.31,34.03) 22.24,33.69 22.24,31.99 arc(22.05,31.02) 21.5,30.19 19.67,28.37 arc(19.45,28.02) v1(19.37,27.62)
TIM3_CH2: length 9.6
  Top Layer w0.203: U5.57 v1(18.86,27.24)
  Inner2 w0.203: v1(18.86,27.24) 18.86,27.75 arc(18.94,28.15) 19.17,28.49 21.03,30.36 arc(21.58,31.18) 21.78,32.15 21.78,33.67 arc(21.7,34.03) v1(21.5,34.34)
TIM3_CH3: length 20.9
  Top Layer w0.203: v1(18.98,21.27) 20.13,20.12 arc(20.96,19.57) 21.93,19.38 U5.39 ; U62.3 20.5,33.68 v1(20.49,33.67)
  Inner1 w0.203: v1(18.98,21.27) 18.96,21.29 18.96,24.5 arc(19.1,25.16) 19.47,25.73 20.3,26.55 arc(20.65,27.08) 20.77,27.7 20.77,32.99 arc(20.7,33.36) v1(20.49,33.67)
TIM3_CH4: length 21.2
  Top Layer w0.203: v1(19.94,21.19) 20.51,20.62 arc(21.34,20.07) 22.31,19.88 U5.40
  Inner1 w0.203: v1(19.5,35.53) 19.53,35.53 20.76,34.3 arc(21.22,33.61) 21.38,32.8 21.38,27.93 arc(21.19,26.96) 20.64,26.14 19.8,25.3 arc(19.52,24.89) 19.43,24.4 19.43,22.44 arc(19.56,21.77) v1(19.94,21.19)
UART1_RX: length 15
  Top Layer w0.203: U5.59 17.86,24.89 arc(17.79,24.55) v1(17.6,24.26) ; v1(11.5,34.39) U49.2
  Inner1 w0.203: v1(17.6,24.26) arc(17.8,24.55) 17.86,24.9 17.86,26.44 arc(17.67,27.42) 17.12,28.24 11.88,33.48 arc(11.6,33.9) v1(11.5,34.39)
UART1_TX: length 14.6
  Top Layer w0.203: 18.36,25.87 v1(18.36,24.25) ; 12.5,35 12.5,34.4 v1(12.51,34.39)
  Inner1 w0.203: v1(18.36,24.25) 18.36,26.58 arc(18.17,27.55) 17.62,28.38 12.91,33.08 arc(12.64,33.47) 12.53,33.92 12.51,34.25 arc(12.51,34.32) v1(12.51,34.39)
UART2_RX: length 15.7
  Top Layer w0.203: v1(14.97,12.52) 14.97,12.64 arc(15.03,12.92) 15.19,13.15 arc(15.3,13.33) 15.34,13.54 15.34,13.84
  Inner1 w0.203: v1(22.52,5.13) 16.44,5.13 arc(15.4,5.56) 14.97,6.6 v1(14.97,12.52)
UART2_TX: length 18.3
  Top Layer w0.203: v1(14.44,13.05) 14.1,13.38 arc(13.55,14.21) 13.36,15.18 U5.16
  Inner1 w0.203: v1(14.44,13.05) 14.44,6.49 arc(15,5.15) 16.34,4.59 21.44,4.59
  vias: v1(21.5,4.54)
UART3_RX: length 19.6
  Top Layer w0.203: v1(16.44,23.17) 16.62,23.35 arc(16.99,23.6) 17.42,23.68 20.6,23.68 arc(21.14,23.91) 21.36,24.44 U5.52
  Inner1 w0.203: v1(16.44,23.17) 7.79,23.17 arc(6.61,22.69) 6.12,21.51 6.12,21.11 arc(5.95,20.68) v1(5.52,20.51)
UART3_TX: length 19.9
  Top Layer w0.203: U5.51 21.86,24.53 arc(21.46,23.57) 20.51,23.17 v1(17.46,23.17)
  Inner1 w0.203: v1(17.46,23.17) 17.25,23.38 arc(16.92,23.61) 16.53,23.68 7.68,23.68 arc(6.15,23.05) v1(5.52,21.52)
UART4_RX: length 10.6
  Top Layer w0.203: U46.2 5.04,12.88 arc(5.6,12.99) 6.06,13.3 6.43,13.67 arc(7.25,14.22) 8.22,14.41 10.87,14.41 arc(11.49,14.67) 11.75,15.29 11.75,16.15 arc(11.8,16.42) 11.95,16.65 arc(12.2,16.82) 12.5,16.88 U5.15
UART4_TX: length 10.5
  Top Layer w0.203: U46.1 5,13.9 5.65,13.9 5.86,14.12 arc(6.61,14.62) 7.49,14.79 10.84,14.79 arc(11.21,14.95) 11.36,15.31 11.36,16.25 arc(11.42,16.55) 11.59,16.8 11.82,17.03 arc(12.21,17.29) 12.66,17.38 U5.14
UART5_RX: length 20.4
  Top Layer w0.203: 29.5,35 29.5,34.99 v1(29.5,34.39) ; U5.54 20.36,25.21 arc(20.27,24.73) v1(20,24.34)
  Inner1 w0.203: 19.97,24.49 20.33,24.84 arc(21.15,25.39) 22.12,25.59 27.86,25.59 arc(29.19,26.14) 29.74,27.47 29.74,33.8 arc(29.68,34.12) v1(29.5,34.39)
UART5_TX: length 19.8
  Top Layer w0.203: U5.53 20.86,24.83 arc(20.8,24.54) v1(20.64,24.29)
  Inner1 w0.203: v1(20.64,24.29) 20.74,24.39 arc(21.56,24.94) 22.53,25.13 27.93,25.13 arc(29.56,25.81) 30.24,27.44 30.24,33.78 arc(30.31,34.12) v1(30.5,34.4)
UART6_RX: length 16.6
  Top Layer w0.203: U5.38 26.21,18.88 v1(26.32,18.98)
  Inner1 w0.203: v1(26.32,18.98) 30.92,18.98 arc(32.9,18.16) 33.72,16.19 33.72,11.11 arc(33.9,10.66) v1(34.35,10.47)
UART6_TX: length 17
  Top Layer w0.203: U5.37 24.89,18.41 26.83,18.41 v1(26.86,18.38)
  Inner1 w0.203: v1(26.86,18.38) 31.02,18.38 arc(32.57,17.74) 33.21,16.19 33.21,10.6 arc(33.54,9.79) v1(34.35,9.46)
$1N1015: length 2.4
  Top Layer w0.203: U2.5 11.07,29.69 arc(10.92,28.91) R9.2
$1N2558: length 2
  Top Layer w0.28: C10.2 17.4,29.2 arc(17.47,29.56) 17.67,29.87 17.83,30.02 arc(17.92,30.15) 17.96,30.31 arc(17.96,30.32) 17.96,30.33
$1N22340: length 4.2
  Top Layer w0.254: U5.47 26.62,23.38 arc(27.71,22.93) 28.16,21.84
$1N22341: length 4.9
  Top Layer w0.254: U5.31 22.36,13.52 arc(22.65,12.83) 23.34,12.54 24.22,12.54 arc(24.96,12.23) C21.2
$1N24539: length 3.2
  Top Layer w0.203: 30.04,4.54 30.6,3.98 arc(30.92,3.5) 31.03,2.93 SW3.1 ; R3.1 30.04,4.63
$1N24657: length 3
  Top Layer w0.203: R4.1 10.23,4.32 arc(10.04,3.34) 9.49,2.52 SW4.1
$1N24972: length 9.4
  Top Layer w0.203: v1(3.74,8.82) 2.3,8.82 arc(1.61,8.69) 1.03,8.3 0.94,8.21
  Inner1 w0.203: v1(8.72,12.44) 5.85,9.57 arc(5.03,9.02) 4.06,8.82 v1(3.74,8.82)
$1N24975: length 9
  Top Layer w0.254: LED1.2 v1(3.24,8.21)
  Inner1 w0.203: v1(3.24,8.21) 4.42,8.21 arc(5.4,8.4) 6.22,8.95 9.62,12.35 arc(9.72,12.42) v1(9.83,12.44)
$1N24978: length 10.5
  Top Layer w0.254: v1(3.24,7.55) 2.63,7.55
  Inner1 w0.203: v1(3.24,7.55) 4.8,7.55 arc(5.77,7.75) 6.59,8.3 10.27,11.97 arc(10.76,12.3) v1(11.34,12.42)
$1N25196: length 13.9
  Top Layer w0.203: 20.63,7.94 v1(20.63,7.93)
  Inner1 w0.203: v1(29.4,3.36) 29.4,5.11 arc(29.39,5.34) 29.35,5.57 arc(28.76,6.66) 27.67,7.25 arc(27.44,7.29) 27.21,7.3 22.15,7.3 arc(21.33,7.46) v1(20.63,7.93)
  Bottom Layer w0.203: H1.1 28.74,1.77 arc(28.91,2.63) v1(29.4,3.36)
$1N25385: length 11.8
  Inner1 w0.203: v1(30.29,3.36) 30.29,5.38 arc(30.27,5.68) 30.22,5.97 arc(29.54,7.17) 28.35,7.84 arc(28.05,7.9) 27.75,7.92 v1(23.94,7.92)
  Bottom Layer w0.203: v1(30.29,3.36) 30.39,3.26 arc(30.9,2.5) H2.1

## Copper pours and planes (outline as drawn; the poured copper is in the pictures)
3V3_RF on Top Layer: 15.42,10.14 17.58,10.14 17.58,8.95 15.42,8.95
3V3_RF on Bottom Layer: 15.43,10.14 17.59,10.14 17.59,8.95 15.43,8.95
5V on Top Layer: 36.51,12.02 39.43,12.02 39.43,10.47 36.51,10.47
GND on Top Layer: -4.89,43.5 44.76,43.5 44.76,-3.62 -4.89,-3.62
GND on Bottom Layer: -4.89,43.5 44.76,43.5 44.76,-3.62 -4.89,-3.62
GND on Bottom Layer: 36.64,9.97 39.56,9.97 39.56,7.3 36.64,7.3
GND on Inner1: -4.89,43.5 44.76,43.5 44.76,-3.62 -4.89,-3.62
GND on Inner2: -4.89,43.5 44.76,43.5 44.76,-3.62 -4.89,-3.62

Small or netless copper shapes (teardrops, artwork), in the pictures only: 197 on Top Layer, 21 on Bottom Layer, 77 on Inner1, 5 on Inner2

## Text on the board
Bottom Silkscreen Layer: 5V | GND | DIO | CLK | CH4 | CH3 | CH2 | CH1 | ADC1 | ADC2 | RX | TX | CH8 | CH7 | CH6 | CH5 | SCL | SDA | SWD | I2C1 | UART4 | UART3 | TIM1 | UART1 | UART5 | TIM3
Top Silkscreen Layer: TRG5 | DC5GTR | 1234VG | CDG5 | BTN2 | BTN1
